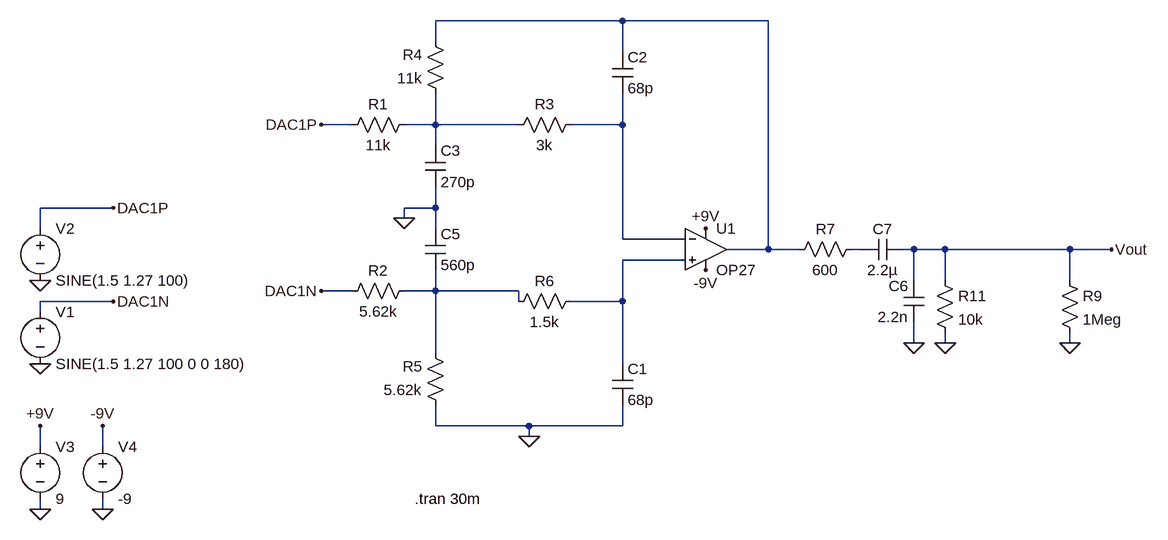
[diagram p0: schematic ad1939_dif.asc]
ad1939_dif.asc, the LTspice schematic file:
Version 4
SHEET 1 2088 680
WIRE 896 -256 608 -256
WIRE 1120 -256 896 -256
WIRE 608 -224 608 -256
WIRE 896 -208 896 -256
WIRE 480 -96 432 -96
WIRE 608 -96 608 -144
WIRE 608 -96 560 -96
WIRE 736 -96 608 -96
WIRE 896 -96 896 -144
WIRE 896 -96 816 -96
WIRE 608 -64 608 -96
WIRE 112 32 0 32
WIRE 608 32 608 0
WIRE 608 32 560 32
WIRE 560 48 560 32
WIRE 0 64 0 32
WIRE 608 64 608 32
WIRE 896 80 896 -96
WIRE 992 80 896 80
WIRE 1120 96 1120 -256
WIRE 1120 96 1056 96
WIRE 1168 96 1120 96
WIRE 1264 96 1248 96
WIRE 1344 96 1328 96
WIRE 1392 96 1344 96
WIRE 1584 96 1392 96
WIRE 1648 96 1584 96
WIRE 992 112 896 112
WIRE 1344 144 1344 96
WIRE 1392 144 1392 96
WIRE 1584 144 1584 96
WIRE 480 160 432 160
WIRE 608 160 608 128
WIRE 608 160 560 160
WIRE 736 160 608 160
WIRE 112 176 0 176
WIRE 736 176 736 160
WIRE 896 176 896 112
WIRE 896 176 816 176
WIRE 0 192 0 176
WIRE 1344 240 1344 208
WIRE 1392 240 1392 224
WIRE 1584 240 1584 224
WIRE 608 256 608 160
WIRE 896 272 896 176
WIRE 608 368 608 336
WIRE 752 368 608 368
WIRE 896 368 896 336
WIRE 896 368 752 368
WIRE 752 384 752 368
WIRE 0 400 0 368
WIRE 96 400 96 368
WIRE 0 496 0 480
WIRE 96 496 96 480
FLAG 0 144 0
FLAG 0 272 0
FLAG 112 32 DAC1P
FLAG 112 176 DAC1N
FLAG 432 -96 DAC1P
FLAG 432 160 DAC1N
FLAG 752 384 0
FLAG 560 48 0
FLAG 96 496 0
FLAG 0 496 0
FLAG 0 368 +9V
FLAG 96 368 -9V
FLAG 1024 64 +9V
FLAG 1024 128 -9V
FLAG 1648 96 Vout
FLAG 1584 240 0
FLAG 1392 240 0
FLAG 1344 240 0
DATAFLAG 1600 96 ""
DATAFLAG 1600 96 ""
DATAFLAG 1600 96 ""
SYMBOL voltage 0 48 R0
WINDOW 123 0 0 Left 0
WINDOW 39 0 0 Left 0
SYMATTR InstName V2
SYMATTR Value SINE(1.5 1.27 100)
SYMBOL res 576 -112 R90
WINDOW 0 0 56 VBottom 2
WINDOW 3 32 56 VTop 2
SYMATTR InstName R1
SYMATTR Value 11k
SYMBOL res 576 144 R90
WINDOW 0 0 56 VBottom 2
WINDOW 3 32 56 VTop 2
SYMATTR InstName R2
SYMATTR Value 5.62k
SYMBOL res 832 -112 R90
WINDOW 0 0 56 VBottom 2
WINDOW 3 32 56 VTop 2
SYMATTR InstName R3
SYMATTR Value 3k
SYMBOL res 624 -128 R180
WINDOW 0 36 76 Left 2
WINDOW 3 36 40 Left 2
SYMATTR InstName R4
SYMATTR Value 11k
SYMBOL res 624 352 R180
WINDOW 0 36 76 Left 2
WINDOW 3 36 40 Left 2
SYMATTR InstName R5
SYMATTR Value 5.62k
SYMBOL res 720 192 R270
WINDOW 0 32 56 VTop 2
WINDOW 3 0 56 VBottom 2
SYMATTR InstName R6
SYMATTR Value 1.5k
SYMBOL cap 880 272 R0
SYMATTR InstName C1
SYMATTR Value 68p
SYMBOL OpAmps\\OP27 1024 32 R0
SYMATTR InstName U1
SYMBOL cap 880 -208 R0
SYMATTR InstName C2
SYMATTR Value 68p
SYMBOL cap 592 -64 R0
SYMATTR InstName C3
SYMATTR Value 270p
SYMBOL cap 592 64 R0
SYMATTR InstName C5
SYMATTR Value 560p
SYMBOL voltage 0 384 R0
WINDOW 123 0 0 Left 0
WINDOW 39 0 0 Left 0
SYMATTR InstName V3
SYMATTR Value 9
SYMBOL voltage 96 384 R0
WINDOW 123 0 0 Left 0
WINDOW 39 0 0 Left 0
SYMATTR InstName V4
SYMATTR Value -9
SYMBOL voltage 0 176 R0
WINDOW 123 0 0 Left 0
WINDOW 39 0 0 Left 0
SYMATTR InstName V1
SYMATTR Value SINE(1.5 1.27 100 0 0 180)
SYMBOL res 1568 128 R0
SYMATTR InstName R9
SYMATTR Value 1Meg
SYMBOL res 1376 128 R0
SYMATTR InstName R11
SYMATTR Value 10k
SYMBOL cap 1360 208 R180
WINDOW 0 24 56 Left 2
WINDOW 3 24 8 Left 2
SYMATTR InstName C6
SYMATTR Value 2.2n
SYMBOL res 1264 80 R90
WINDOW 0 0 56 VBottom 2
WINDOW 3 32 56 VTop 2
SYMATTR InstName R7
SYMATTR Value 600
SYMBOL cap 1328 80 R90
WINDOW 0 0 32 VBottom 2
WINDOW 3 32 32 VTop 2
SYMATTR InstName C7
SYMATTR Value 2.2µ
TEXT 576 480 Left 2 !.tran 30m

The netlist it stands for:
* ad1939_dif.asc
V2 DAC1P 0 SINE(1.5 1.27 100)
R1 N002 DAC1P 11k
R2 N006 DAC1N 5.62k
R3 N003 N002 3k
R4 N002 N001 11k
R5 0 N006 5.62k
R6 N006 N005 1.5k
C1 N005 0 68p
XU1 N005 N003 +9V -9V N001 OP27  ; pins In+ In- V+ V- OUT
C2 N001 N003 68p
C3 N002 0 270p
C5 0 N006 560p
V3 +9V 0 9
V4 -9V 0 -9
V1 DAC1N 0 SINE(1.5 1.27 100 0 0 180)
R9 Vout 0 1Meg
R11 Vout 0 10k
C6 0 Vout 2.2n
R7 N004 N001 600
C7 Vout N004 2.2µ
.tran 30m
.lib ADI.lib
.backanno
.end